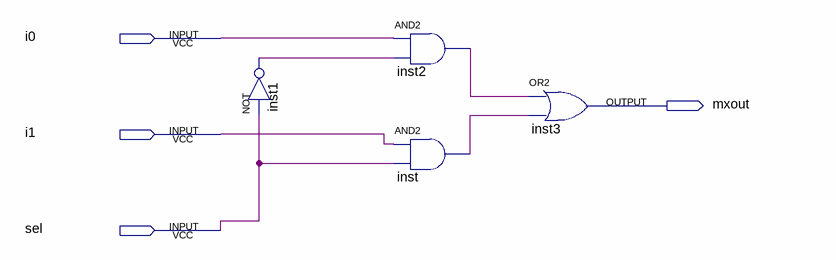
[diagram p0: schematic sheet]
// Quartus schematic Block3.bdf as structural Verilog: 4 symbols, 4 pins
module Block3 (
  input  i0,
  input  i1,
  input  sel,
  output mxout
);

  wire inst1_out, inst2_out, inst_out;

  not inst1 (inst1_out, sel);
  and inst2 (inst2_out, i0, inst1_out);
  and inst (inst_out, i1, sel);
  or inst3 (mxout, inst2_out, inst_out);
endmodule
